# Altium project Standalone Battery Charger.PrjPcb (part 1 of 2)
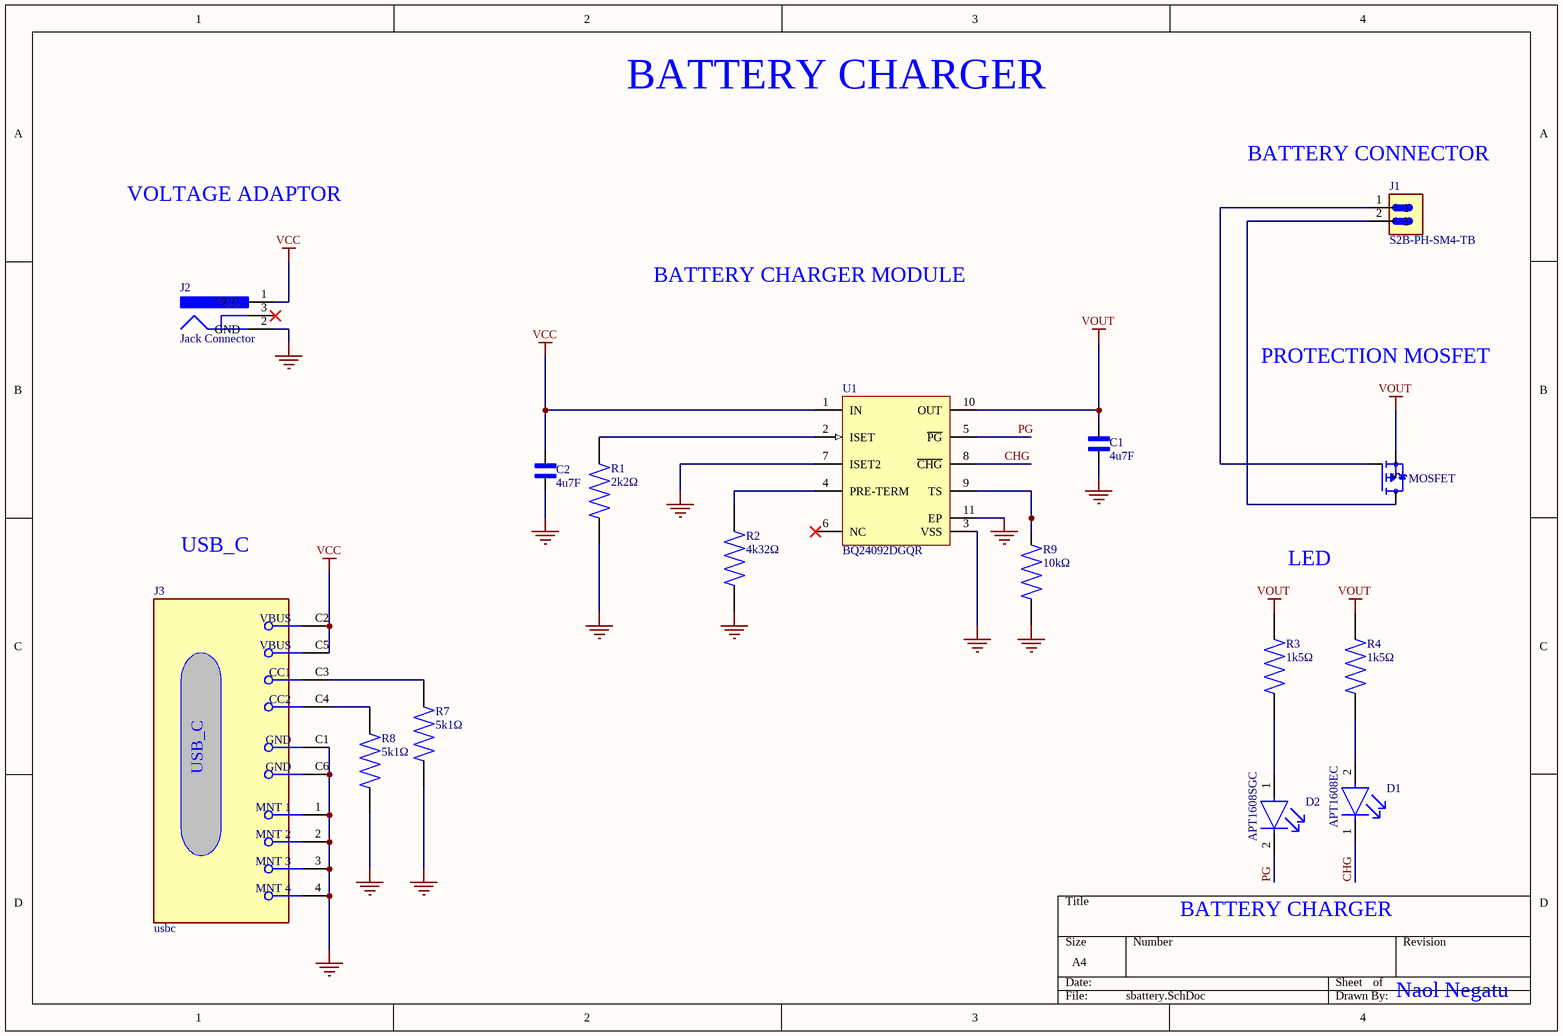
[diagram p0: sbattery.SchDoc]
1 sheet, 16 parts. Net scope: global (net labels, ports and power ports of the same name join across sheets).
Board file: sbattery.PcbDoc

## Sheet sbattery.SchDoc
size A4; SheetNumber: 1; SheetTotal: 1

### Parts
C1  4u7F  [CAPC2012X88N]
C2  4u7F  [CAPC2012X88N]
D1  APT1608EC  [FP-APT1608EC-MFG]
D2  APT1608SGC  [FP-APT2012MGC-MFG]
J1  S2B-PH-SM4-TB  [JST_S2B-PH-SM4-TB]
J2  Jack Connector  [CUI_PJ-002AH-SMT-TR]
J3  usbc  [FP-217176-0001-MFG]
MOSFET  P CHANNEL  [SOT23-3]  (value not drawn)
R1  2k2Ω  [RESC2012X60N]
R2  4k32Ω  [RESC2012X60N]
R3  1k5Ω  [RESC2012X60N]
R4  1k5Ω  [RESC2012X60N]
R7  5k1Ω  [RESC2012X60N]
R8  5k1Ω  [RESC2012X60N]
R9  10kΩ  [RESC2012X60N]
U1  BQ24092DGQR  [DGQ0010D_L]

### Nets
GND: C1.2 C2.2 J2.2(GND) J3.1(MNT_1) J3.2(MNT_2) J3.3(MNT_3) J3.4(MNT_4) J3.C1(GND) J3.C6(GND) R1.1 R2.1 R7.1 R8.1 R9.1 U1.3(VSS) U1.7(ISET2) U1.11(EP)
VCC: C2.1 J2.1(VCC) J3.C2(VBUS) J3.C5(VBUS) U1.1(IN)
VOUT: C1.1 MOSFET.2(S) R3.2 R4.2 U1.10(OUT)
CHG: D1.1(C) U1.8(~{CHG})
PG: D2.2(C) U1.5(~{PG})
NetD1_2: D1.2(A) R4.1
NetD2_1: D2.1(A) R3.1
NetJ1_1: J1.1 MOSFET.1(G)
NetJ1_2: J1.2 MOSFET.3(D)
NetJ3_C3: J3.C3(CC1) R7.2
NetJ3_C4: J3.C4(CC2) R8.2
NetR1_2: R1.2 U1.2(ISET)
NetR2_2: R2.2 U1.4(PRE-TERM)
NetR9_2: R9.2 U1.9(TS)

Not connected (* = marked no-connect by the designer): J2 3*; U1 6(NC)*

### Notes on the sheet
- BATTERY CHARGER
- (near J1) BATTERY CONNECTOR
- VOLTAGE ADAPTOR
- BATTERY CHARGER MODULE
- PROTECTION MOSFET
- USB_C
- LED
- Naol Negatu
- (in symbol 217176-0001) USB_C

### Library data of the parts
C1 C2 = CC0805KFX7R7BB475: Ceramic Capacitor, Ceramic, 16V, 10% +Tol, 10% -Tol, X7R, 0.15 TC, 4.7uF, Surface Mount, 0805; Manufacturer: Yageo Group; Manufacturer Package Identifier: CC0805-0.85; Supplier: DigiKey; Supplier Part Number: 13-CC0805KFX7R7BB475TR-ND; Manufacturer Part Number: CC0805KFX7R7BB475; RoHS: Compliant; Category: Ceramic Capacitors; Stock: 10000; Pricing: 10000=0.12617, 30000=0.11755 (USD); Value: 4.7uF; Case/Package: 0805; China RoHS: Compliant; Country of Origin: Mainland China, Taiwan; Dielectric: X7R; Dielectric Material: Ceramic; Export Control Classification Number (ECCN) Code: EAR99; Halogen Free: Halogen Free; Height: 1.25mm; Harmonized Tariff Schedule (HTS) Code: 8532.24.00.20; Introduction Date: 2013-05-20; Lead Free: Lead Free; Length: 2mm; Lifecycle Status: Production; Material: Ceramic; Max Operating Temperature: 125°C; Min Operating Temperature: -55°C; Mounting Technology: Surface Mount; Number of Terminals: 2; REACH SVHC: Unaffected; Voltage Rating: 16V; Voltage Rating (DC): 16V; Width: 1.25mm; ComponentLink1URL: https://datasheet.octopart.com:443/CC0805KFX7R7BB475-Yageo-datasheet-177165144.pdf?src-supplier=IHS; ComponentLink1Description: https://datasheet.octopart.com:443/CC0805KFX7R7BB475-Yageo-datasheet-177165144.pdf?src-supplier=IHS; ComponentLink2URL: https://datasheet.octopart.com:443/CC0805KFX7R7BB475-Yageo-datasheet-78855689.pdf?src-supplier=Upverter; ComponentLink2Description: https://datasheet.octopart.com:443/CC0805KFX7R7BB475-Yageo-datasheet-78855689.pdf?src-supplier=Upverter; ComponentLink3URL: https://datasheet.octopart.com:443/CC0805KFX7R7BB475-Yageo-datasheet-181969532.pdf?src-supplier=Farnell; ComponentLink3Description: https://datasheet.octopart.com:443/CC0805KFX7R7BB475-Yageo-datasheet-181969532.pdf?src-supplier=Farnell; ComponentLink4URL: https://datasheet.octopart.com/CC0805KFX7R7BB475-Yageo-datasheet-10883670.pdf; ComponentLink4Description: https://datasheet.octopart.com/CC0805KFX7R7BB475-Yageo-datasheet-10883670.pdf; ComponentLink5URL: http://sigma.octopart.com:80/conflict_mineral_statement/Yageo-company-3.pdf?src-supplier=Compliance+Statements; ComponentLink5Description: http://sigma.octopart.com:80/conflict_mineral_statement/Yageo-company-3.pdf?src-supplier=Compliance+Statements; ComponentLink6URL: http://sigma.octopart.com:80/rohs_statement/Yageo-company-2.pdf?src-supplier=Compliance+Statements; ComponentLink6Description: http://sigma.octopart.com:80/rohs_statement/Yageo-company-2.pdf?src-supplier=Compliance+Statements; LCSC part#: C20144929
D1 = APT1608EC: 1.6X0.8 MM SMD CHIP LED LAMP Single Color LED, High Efficiency Red, Water Clear, 1.2mm; Manufacturer: Kingbright; Dominant Wavelength: 625nm; Forward Current: 30mA; Forward Voltage: 2.5V; Lens Style: Clear, Flat; Luminous Intensity: 12mcd; Max Junction Temperature (Tj): 125°C; Number of Circuits: 1; Peak Wavelength: 627nm; Power Dissipation: 75mW; Reverse Voltage: 5V; Shape: Rectangular; Test Current: 20mA; Viewing Angle: 120°; Wavelength: 617nm; Supplier: DigiKey; Supplier Part Number: 754-1117-1-ND; Manufacturer Part Number: APT1608EC; RoHS: Compliant; Category: LEDs; Stock: 214921; Pricing: 1=0.19, 10=0.129, 100=0.0899, 500=0.07172, 1000=0.06568 (USD); Case/Package: 0603; Case Code (Imperial): 0603; Case Code (Metric): 1608; China RoHS: Compliant; Color: Red; Country of Origin: Mainland China; Height: 750µm; Harmonized Tariff Schedule (HTS) Code: 8541.40.20.00; Illumination Color: Red; Introduction Date: 2000-01-01; Lead Free: Lead Free; Length: 1.6mm; Lens Color: Clear; Lifecycle Status: Production; Max Operating Temperature: 85°C; Min Operating Temperature: -40°C; Mounting Technology: Surface Mount; Number of LEDs: 1; Pins: 2; Number of Terminals: 2; Packaging: Tape & Reel (TR); REACH SVHC: Unaffected; Schedule B: 8541402000, 8541402000|8541402000, 8541402000|8541402000|8541402000, 8541402000|8541402000|8541402000|8541402000; Terminal Pitch: 1.3mm; Width: 800µm; ComponentLink1URL: https://datasheet.octopart.com:443/APT1608EC-Kingbright-datasheet-180517227.pdf?src-supplier=IHS; ComponentLink1Description: https://datasheet.octopart.com:443/APT1608EC-Kingbright-datasheet-180517227.pdf?src-supplier=IHS; ComponentLink2URL: https://datasheet.octopart.com:443/APT1608EC-Kingbright-datasheet-158247.pdf?src-supplier=IHS; ComponentLink2Description: https://datasheet.octopart.com:443/APT1608EC-Kingbright-datasheet-158247.pdf?src-supplier=IHS; ComponentLink3URL: https://datasheet.octopart.com:443/APT1608EC-Kingbright-datasheet-12510518.pdf?src-supplier=Upverter; ComponentLink3Description: https://datasheet.octopart.com:443/APT1608EC-Kingbright-datasheet-12510518.pdf?src-supplier=Upverter; ComponentLink4URL: https://datasheet.octopart.com:443/APT1608EC-Kingbright-datasheet-137321905.pdf?src-supplier=Sager+Electronics; ComponentLink4Description: https://datasheet.octopart.com:443/APT1608EC-Kingbright-datasheet-137321905.pdf?src-supplier=Sager+Electronics; ComponentLink5URL: https://datasheet.octopart.com:443/APT1608EC-Kingbright-datasheet-9700807.pdf?src-supplier=RS+(Formerly+Allied+Electronics); ComponentLink5Description: https://datasheet.octopart.com:443/APT1608EC-Kingbright-datasheet-9700807.pdf?src-supplier=RS+(Formerly+Allied+Electronics); LCSC part#: C5554143
D2 = APT1608SGC: LED High-Power Uni-Color Super Bright Green 565nm 2.2V 2-Pin Chip LED T/R; Manufacturer: Kingbright; Dominant Wavelength: 568nm; Forward Current: 25mA; Forward Voltage: 2.5V; Lens Color: Clear; Lens Style: Clear, Flat; Luminous Intensity: 10mcd; Max Junction Temperature (Tj): 110°C; Number of Circuits: 1; Power Dissipation: 62.5mW; Reverse Voltage: 5V; Shape: Rectangular; Test Current: 20mA; Viewing Angle: 120°; Supplier: DigiKey; Supplier Part Number: 754-1121-1-ND; Manufacturer Part Number: APT1608SGC; RoHS: Compliant; Category: LEDs; Stock: 1784429; Pricing: 1=0.2, 10=0.137, 100=0.0953, 500=0.07602, 1000=0.06962 (USD); Case/Package: 0603; Case Code (Imperial): 0603; Case Code (Metric): 1608; China RoHS: Compliant; Color: Green; Height: 750µm; Illumination Color: Green; Lead Free: Lead Free; Length: 1.6mm; Lifecycle Status: Production; Max Operating Temperature: 85°C; Min Operating Temperature: -40°C; Mounting Technology: Surface Mount; Number of LEDs: 1; Pins: 2; Number of Terminals: 2; Packaging: Tape & Reel (TR); Peak Wavelength: 565nm; REACH SVHC: Unaffected; Schedule B: 8541402000, 8541402000|8541402000|8541402000|8541402000|8541402000|8541402000|8541402000|8541402000|8541402000|8541402000|8541402000|8541402000|8541402000|8541402000|8541402000|8541402000|8541402000|8541402000|8541402000|8541402000|8541402000|8541402000|8541402000|85; Terminal Pitch: 1.65mm; Wavelength: 568nm; Width: 800µm; ComponentLink1URL: https://datasheet.octopart.com:443/APT1608SGC-Kingbright-datasheet-180517294.pdf?src-supplier=IHS; ComponentLink1Description: https://datasheet.octopart.com:443/APT1608SGC-Kingbright-datasheet-180517294.pdf?src-supplier=IHS; ComponentLink2URL: https://datasheet.octopart.com:443/APT1608SGC-Kingbright-datasheet-158301.pdf?src-supplier=IHS; ComponentLink2Description: https://datasheet.octopart.com:443/APT1608SGC-Kingbright-datasheet-158301.pdf?src-supplier=IHS; ComponentLink3URL: https://datasheet.octopart.com:443/APT1608SGC-Kingbright-datasheet-8328416.pdf?src-supplier=Upverter; ComponentLink3Description: https://datasheet.octopart.com:443/APT1608SGC-Kingbright-datasheet-8328416.pdf?src-supplier=Upverter; LCSC part#: C5875754
J1 = S2B-PH-SM4-TB: Board Connector, 2 Contact(s), 1 Row(s), Male, Right Angle, Surface Mount Terminal; Manufacturer: JST; Contact Resistance: 20mΩ; Current Rating: 2A; Dielectric Material: Polyamide; Insulation Resistance: 1GΩ; Number of Poles: 2; Pitch: 2.0066mm; Ratings: CSA, TUV; Supplier: DigiKey; Supplier Part Number: 455-S2B-PH-SM4-TBCT-ND; Manufacturer Part Number: S2B-PH-SM4-TB; RoHS: Compliant; Category: Card Edge Connectors; Stock: 150546; Pricing: 1=0.49, 10=0.417, 100=0.3547, 500=0.31654 (USD); Case/Package: SMD/SMT; Contact Plating: Tin; Gender: Male; Height: 5.5mm; Length: 7.9mm; Lifecycle Status: Production; Max Operating Temperature: 85°C; Min Operating Temperature: -25°C; Pins: 2; Number of Positions: 2; Number of Rows: 1; Orientation: Right Angle; Terminal Pitch: 2mm; Width: 7.6mm; ComponentLink1URL: https://datasheet.octopart.com:443/S2B-PH-SM4-TB-JST-datasheet-15068535.pdf?src-supplier=IHS; ComponentLink1Description: https://datasheet.octopart.com:443/S2B-PH-SM4-TB-JST-datasheet-15068535.pdf?src-supplier=IHS; ComponentLink2URL: https://datasheet.octopart.com:443/S2B-PH-SM4-TB-JST-datasheet-12510261.pdf?src-supplier=TME; ComponentLink2Description: https://datasheet.octopart.com:443/S2B-PH-SM4-TB-JST-datasheet-12510261.pdf?src-supplier=TME; ComponentLink3URL: https://datasheet.octopart.com:443/S2B-PH-SM4-TB-JST-datasheet-159515011.pdf?src-supplier=HQonline; ComponentLink3Description: https://datasheet.octopart.com:443/S2B-PH-SM4-TB-JST-datasheet-159515011.pdf?src-supplier=HQonline
J2 = PJ-002AH-SMT-TR: 2.0 x 6.5 mm, 5.0 A, Horizontal, Surface Mount (SMT), Dc Power Jack Connector; Manufacturer: Same Sky; Current Rating: 5A; Inside Diameter: 2mm; Number of Conductors: 2; Outside Diameter: 6.5mm; Shielding: Unshielded; Voltage Rating: 24V; Supplier: DigiKey; Supplier Part Number: CP-002AHPJDKR-ND; Manufacturer Part Number: PJ-002AH-SMT-TR; RoHS: Compliant; Category: Power Connectors; Stock: 87808; Pricing: 1=1.31, 10=1.109, 25=1.0396, 50=0.99, 100=0.9426 (USD); Contact Plating: Silver; Country of Origin: Mainland China; Export Control Classification Number (ECCN) Code: EAR99; Harmonized Tariff Schedule (HTS) Code: 8536.69.40.20; Introduction Date: 2015-12-23; Lifecycle Status: Production; Max Operating Temperature: 85°C; Min Operating Temperature: -25°C; Mounting Technology: Surface Mount; Pins: 2; Orientation: Horizontal; REACH SVHC: Unaffected; Schedule B: 8536695050; Voltage Rating (DC): 24V; ComponentLink1URL: https://datasheet.octopart.com:443/PJ-002AH-SMT-TR-Same-Sky-datasheet-183081436.pdf?src-supplier=Same+Sky; ComponentLink1Description: https://datasheet.octopart.com:443/PJ-002AH-SMT-TR-Same-Sky-datasheet-183081436.pdf?src-supplier=Same+Sky; ComponentLink2URL: https://datasheet.octopart.com:443/PJ-002AH-SMT-TR-Same-Sky-datasheet-181917114.pdf?src-supplier=Same+Sky; ComponentLink2Description: https://datasheet.octopart.com:443/PJ-002AH-SMT-TR-Same-Sky-datasheet-181917114.pdf?src-supplier=Same+Sky; ComponentLink3URL: https://datasheet.octopart.com:443/PJ-002AH-SMT-TR-CUI-Devices-datasheet-175924689.pdf?src-supplier=Same+Sky; ComponentLink3Description: https://datasheet.octopart.com:443/PJ-002AH-SMT-TR-CUI-Devices-datasheet-175924689.pdf?src-supplier=Same+Sky; ComponentLink4URL: https://datasheet.octopart.com:443/PJ-002AH-SMT-TR-CUI-Devices-datasheet-137940666.pdf?src-supplier=Same+Sky; ComponentLink4Description: https://datasheet.octopart.com:443/PJ-002AH-SMT-TR-CUI-Devices-datasheet-137940666.pdf?src-supplier=Same+Sky; ComponentLink5URL: https://datasheet.octopart.com:443/PJ-002AH-SMT-TR-CUI-Devices-datasheet-180437148.pdf?src-supplier=IHS; ComponentLink5Description: https://datasheet.octopart.com:443/PJ-002AH-SMT-TR-CUI-Devices-datasheet-180437148.pdf?src-supplier=IHS; ComponentLink6URL: https://datasheet.octopart.com:443/PJ-002AH-SMT-TR-Same-Sky-datasheet-190141953.pdf?src-supplier=element14+APAC; ComponentLink6Description: https://datasheet.octopart.com:443/PJ-002AH-SMT-TR-Same-Sky-datasheet-190141953.pdf?src-supplier=element14+APAC; ComponentLink7URL: https://datasheet.octopart.com:443/PJ-002AH-SMT-TR-Same-Sky-datasheet-182880855.pdf?src-supplier=Electro+Sonic; ComponentLink7Description: https://datasheet.octopart.com:443/PJ-002AH-SMT-TR-Same-Sky-datasheet-182880855.pdf?src-supplier=Electro+Sonic; ComponentLink8URL: https://datasheet.octopart.com:443/PJ-002AH-SMT-TR-CUI-Devices-datasheet-175925525.pdf?src-supplier=Master+Electronics; ComponentLink8Description: https://datasheet.octopart.com:443/PJ-002AH-SMT-TR-CUI-Devices-datasheet-175925525.pdf?src-supplier=Master+Electronics; ComponentLink9URL: https://datasheet.octopart.com:443/PJ-002AH-SMT-TR-CUI-Devices-datasheet-141000103.pdf?src-supplier=Master+Electronics; ComponentLink9Description: https://datasheet.octopart.com:443/PJ-002AH-SMT-TR-CUI-Devices-datasheet-141000103.pdf?src-supplier=Master+Electronics; ComponentLink10URL: https://datasheet.octopart.com:443/PJ-002AH-SMT-TR-CUI-Devices-datasheet-103108616.pdf?src-supplier=Master+Electronics; ComponentLink10Description: https://datasheet.octopart.com:443/PJ-002AH-SMT-TR-CUI-Devices-datasheet-103108616.pdf?src-supplier=Master+Electronics; ComponentLink11URL: https://datasheet.octopart.com:443/PJ-002AH-SMT-TR-Same-Sky-datasheet-189105089.pdf?src-supplier=Master+Electronics; ComponentLink11Description: https://datasheet.octopart.com:443/PJ-002AH-SMT-TR-Same-Sky-datasheet-189105089.pdf?src-supplier=Master+Electronics; ComponentLink12URL: https://datasheet.octopart.com:443/PJ-002AH-SMT-TR-Same-Sky-datasheet-182049753.pdf?src-supplier=Future+Electronics; ComponentLink12Description: https://datasheet.octopart.com:443/PJ-002AH-SMT-TR-Same-Sky-datasheet-182049753.pdf?src-supplier=Future+Electronics; ComponentLink13URL: https://datasheet.octopart.com:443/PJ-002AH-SMT-TR-CUI-Devices-datasheet-175923546.pdf?src-supplier=Future+Electronics; ComponentLink13Description: https://datasheet.octopart.com:443/PJ-002AH-SMT-TR-CUI-Devices-datasheet-175923546.pdf?src-supplier=Future+Electronics; ComponentLink14URL: https://datasheet.octopart.com:443/PJ-002AH-SMT-TR-CUI-Devices-datasheet-137760669.pdf?src-supplier=Future+Electronics; ComponentLink14Description: https://datasheet.octopart.com:443/PJ-002AH-SMT-TR-CUI-Devices-datasheet-137760669.pdf?src-supplier=Future+Electronics; ComponentLink15URL: https://datasheet.octopart.com:443/PJ-002AH-SMT-TR-CUI-Devices-datasheet-175927503.pdf?src-supplier=CUI+Devices+SCT; ComponentLink15Description: https://datasheet.octopart.com:443/PJ-002AH-SMT-TR-CUI-Devices-datasheet-175927503.pdf?src-supplier=CUI+Devices+SCT; ComponentLink16URL: https://datasheet.octopart.com:443/PJ-002AH-SMT-TR-CUI-Devices-datasheet-142370533.pdf?src-supplier=CUI+Devices+SCT; ComponentLink16Description: https://datasheet.octopart.com:443/PJ-002AH-SMT-TR-CUI-Devices-datasheet-142370533.pdf?src-supplier=CUI+Devices+SCT; ComponentLink17URL: https://octopart.com:443/opatz8j6/c1?t=kYIPSAR_gxUrGLbD9baLFzEuLKDMD5QbHOfTDtLDkIqxLNdFXvSU7Zzvbvr2f7sXWfJxGRNhyTJmv_QM2CcXh6cB5txDjHKaRxA5LmQs8X3aOvPrphm1D1Gy4PUj3vydGShGnZzSROeM_0jDyTswWqCxsUuZ_G6TA39kgUgXMsYisotAvci6PBnwfHqprWkdovafhHLXXr438B9LgzH30NnnvdlFCxTuLfhx65YnuPwilhRuSo-RN6yLVuYx4bYU1Kz2gKifPRymKpwQpeAPMT-vPCIQg4kms4wOaB4PSnPbik8Fpc3R-s-2nw5NXz5D3_1YqpzlG--L1JdtoD8M3IP8kJK4AiMg9MwAvbI&src-supplier=Compliance+Statements; ComponentLink17Description: https://octopart.com:443/opatz8j6/c1?t=kYIPSAR_gxUrGLbD9baLFzEuLKDMD5QbHOfTDtLDkIqxLNdFXvSU7Zzvbvr2f7sXWfJxGRNhyTJmv_QM2CcXh6cB5txDjHKaRxA5LmQs8X3aOvPrphm1D1Gy4PUj3vydGShGnZzSROeM_0jDyTswWqCxsUuZ_G6TA39kgUgXMsYisotAvci6PBnwfHqprWkdovafhHLXXr438B9LgzH30NnnvdlFCxTuLfhx65YnuPwilhRuSo-RN6yLVuYx4bYU1Kz2gKifPRymKpwQpeAPMT-vPCIQg4kms4wOaB4PSnPbik8Fpc3R-s-2nw5NXz5D3_1YqpzlG--L1JdtoD8M3IP8kJK4AiMg9MwAvbI&src-supplier=Compliance+Statements; ComponentLink18URL: https://octopart.com:443/opatz8j6/c1?t=fCyWSj1jxHABX9bt1We-nBaONF-MKDyrdplWq9Ug6JX_mli73eFFCsHYdxw9c0yzn_n1hCXT5_MgR08zVo_XE-0LRftrscC4ncIG4fChnThfa4QkZ7D2kog3cmEkcq4mR6SQXbgR_BVap4JxImoweEwxe7EsrUn-gPrEzMW2H8ciz9OuWAMpPZ_4ifjdUiW6Du80lifleXXgru2rFP4QuH4Xg6petDpd_ciFnpWCXseW6pV3jSW7cwaSt3UROAB3Rgj_aBuMIzOubfE_Z-csyZ2KwTmrt1iiK2dgwigDFraz9g52IgOt5U_Koq0hn0IZE5PScfFEQBZO3DXy-6P3QmCScIzCxDK0aqapQeudmZ-b&src-supplier=Compliance+Statements; ComponentLink18Description: https://octopart.com:443/opatz8j6/c1?t=fCyWSj1jxHABX9bt1We-nBaONF-MKDyrdplWq9Ug6JX_mli73eFFCsHYdxw9c0yzn_n1hCXT5_MgR08zVo_XE-0LRftrscC4ncIG4fChnThfa4QkZ7D2kog3cmEkcq4mR6SQXbgR_BVap4JxImoweEwxe7EsrUn-gPrEzMW2H8ciz9OuWAMpPZ_4ifjdUiW6Du80lifleXXgru2rFP4QuH4Xg6petDpd_ciFnpWCXseW6pV3jSW7cwaSt3UROAB3Rgj_aBuMIzOubfE_Z-csyZ2KwTmrt1iiK2dgwigDFraz9g52IgOt5U_Koq0hn0IZE5PScfFEQBZO3DXy-6P3QmCScIzCxDK0aqapQeudmZ-b&src-supplier=Compliance+Statements; ComponentLink19URL: https://octopart.com:443/opatz8j6/c1?t=0G-ZbAozWDGaR5fAvdYjYVtahk3gonqNyEJgXYJdug8omsuN04aVXyE58rj41QlRKAj4lmPkVISqHmGdARiA99ILvFFkrrxah6GHPw6icDB6trS5MVDK3fgU_a4dZEeAnpK2Ogvp-0yutgNUwIMmgdbXs2uUjS2mosDdu4tICyz8yilXvZVabm6iwhWmm8-jY6OOJQggx-TMn65xiw5RMquBda3qZwV9eRGf3QHlh-G12LhJ3Hu32jBT-ZU5ne2OObtiOfBcZ5xkNxnCIi8vCc_XFZUgAheXvRHUilqF4Lu3rtnHWfWuyEiixHsIJalKzzqq94ThQJalGNRoZr9AuwcZBJKcZfHq-pyA3Uw&src-supplier=Compliance+Statements; ComponentLink19Description: https://octopart.com:443/opatz8j6/c1?t=0G-ZbAozWDGaR5fAvdYjYVtahk3gonqNyEJgXYJdug8omsuN04aVXyE58rj41QlRKAj4lmPkVISqHmGdARiA99ILvFFkrrxah6GHPw6icDB6trS5MVDK3fgU_a4dZEeAnpK2Ogvp-0yutgNUwIMmgdbXs2uUjS2mosDdu4tICyz8yilXvZVabm6iwhWmm8-jY6OOJQggx-TMn65xiw5RMquBda3qZwV9eRGf3QHlh-G12LhJ3Hu32jBT-ZU5ne2OObtiOfBcZ5xkNxnCIi8vCc_XFZUgAheXvRHUilqF4Lu3rtnHWfWuyEiixHsIJalKzzqq94ThQJalGNRoZr9AuwcZBJKcZfHq-pyA3Uw&src-supplier=Compliance+Statements; ComponentLink20URL: https://octopart.com:443/opatz8j6/c1?t=O9FJ77n277rZYT1vkW-sWDyE1Ea4dVQNwVeXrCs_O4FYIapCNdmThiJo2jJrijPrL5plgIdh588x2jFYVz6_ITNsv76ycHfSK8IUBrcl_7pxBzvZPRWXWk3EBfsemLjM5yV3VaWa1Vo-8vRT0cyQB5zJkMm-fcl1dDgpq3pzZBR-jy3vPTE_fAtu0Xoza9pCNi_-J4HQu4RdNbXTh_Ts3xIhgv7O5lVkarbUzKhnZRmGVQS2fagVjKU-i7LcVv1hTKNIVRxniNVql0YCjdDdjd0--Hqa6cpsza62t2-gsN6fkLgXXcnbAoJISjka-kHDmTuIB7ntE-61a8hiS-W_NX0-Y6auNOsYkr9uJQIUeTVs&src-supplier=Compliance+Statements; ComponentLink20Description: https://octopart.com:443/opatz8j6/c1?t=O9FJ77n277rZYT1vkW-sWDyE1Ea4dVQNwVeXrCs_O4FYIapCNdmThiJo2jJrijPrL5plgIdh588x2jFYVz6_ITNsv76ycHfSK8IUBrcl_7pxBzvZPRWXWk3EBfsemLjM5yV3VaWa1Vo-8vRT0cyQB5zJkMm-fcl1dDgpq3pzZBR-jy3vPTE_fAtu0Xoza9pCNi_-J4HQu4RdNbXTh_Ts3xIhgv7O5lVkarbUzKhnZRmGVQS2fagVjKU-i7LcVv1hTKNIVRxniNVql0YCjdDdjd0--Hqa6cpsza62t2-gsN6fkLgXXcnbAoJISjka-kHDmTuIB7ntE-61a8hiS-W_NX0-Y6auNOsYkr9uJQIUeTVs&src-supplier=Compliance+Statements; LCSC part#: C2961147
J3 = 217176-0001: USB Connector, Receptacle, USB 2.0, USB Type C, 6 Ways, Gold, SMT, Right Angle, Copper Alloy; Manufacturer: Molex; Manufacturer Lifecycle Status: ACTIVE; Contact Resistance: 50mΩ; Current Rating: 1.25A; Gender: Female; Insulation Resistance: 100MΩ; Number of Contacts: 6; Number of Ports: 1; Plating Thickness: 25.4nm; USB Standard: USB 2.0; Voltage Rating: 30V; Supplier: Avnet; Supplier Part Number: 217176-0001; Manufacturer Part Number: 217176-0001; RoHS: Compliant; Category: USB Connectors; Stock: 32400; Pricing: 3600=1.1115, 10800=0.95376, 21600=0.91268, 43200=0.84734, 100800=0.8202 (USD); China RoHS: Compliant; Contact Material: Gold, Nickel; Country of Origin: Mainland China; Export Control Classification Number (ECCN) Code: EAR99; Harmonized Tariff Schedule (HTS) Code: 8536.69.40.30; Insulation Color: Black; Introduction Date: 2021-08-26; Lifecycle Status: Production; Max Operating Temperature: 85°C; Min Operating Temperature: -40°C; Pins: 6; Number of Positions: 6; Number of Rows: 1; Orientation: Right Angle; REACH SVHC: Unaffected; Shell Finish: Nickel; Shell Material: Stainless Steel; Terminal Pitch: 1.02mm; ComponentLink1URL: https://sigma.octopart.com:443/158830329/technical_drawing/Molex-217176-0001.pdf?src-supplier=Upverter; ComponentLink1Description: https://sigma.octopart.com:443/158830329/technical_drawing/Molex-217176-0001.pdf?src-supplier=Upverter; ComponentLink2URL: https://datasheet.octopart.com:443/217176-0001-Molex-datasheet-164573281.pdf?src-supplier=RS+(Formerly+Allied+Electronics); ComponentLink2Description: https://datasheet.octopart.com:443/217176-0001-Molex-datasheet-164573281.pdf?src-supplier=RS+(Formerly+Allied+Electronics); ComponentLink3URL: http://sigma.octopart.com:80/reach_statement/Molex-company-74.pdf?src-supplier=Compliance+Statements; ComponentLink3Description: http://sigma.octopart.com:80/reach_statement/Molex-company-74.pdf?src-supplier=Compliance+Statements; ComponentLink4URL: http://sigma.octopart.com:80/rohs_statement/Molex-company-73.pdf?src-supplier=Compliance+Statements; ComponentLink4Description: http://sigma.octopart.com:80/rohs_statement/Molex-company-73.pdf?src-supplier=Compliance+Statements; ComponentLink5URL: http://sigma.octopart.com:80/conflict_mineral_statement/Molex-company-72.pdf?src-supplier=Compliance+Statements; ComponentLink5Description: http://sigma.octopart.com:80/conflict_mineral_statement/Molex-company-72.pdf?src-supplier=Compliance+Statements; LCSC part#: C3197950
MOSFET = AO3401A: Transistor: P-MOSFET; unipolar; -30V; 4, 2A; 1, 4W; 85 mOhm; ; -55+150 st.C; SMD; SOT23; Manufacturer: Alpha & Omega Semiconductor; Continuous Drain Current (ID): 4A; Drain to Source Resistance: 50mΩ; Gate to Source Voltage (Vgs): 12V; Input Capacitance: 1.2nF; Max Junction Temperature (Tj): 150°C; Max Power Dissipation: 1.4W; Min Breakdown Voltage: 30V; Number of Channels: 1; Rds On Max: 44mΩ; Threshold Voltage: -900mV; Turn-Off Delay Time: 41ns; Turn-On Delay Time: 6.5ns; Supplier: DigiKey; Supplier Part Number: 785-1001-1-ND; Manufacturer Part Number: AO3401A; RoHS: Compliant; Category: MOSFETs; Stock: 390499; Pricing: 1=0.52, 10=0.322, 50=0.2332, 100=0.2043, 500=0.15316 (USD); Case/Package: TO-236-3; Country of Origin: Mainland China; Drain to Source Breakdown Voltage: -30V; Drain to Source Voltage (Vds): -30V; Export Control Classification Number (ECCN) Code: EAR99; Height: 1.25mm; Introduction Date: 2007-04-10; Lead Free: Lead Free; Lifecycle Status: Production; Max Operating Temperature: 150°C; Min Operating Temperature: -55°C; Mounting Technology: Surface Mount; Number of Elements: 1; Pins: 3; Number of Terminals: 3; Power Dissipation: 1.4W; Radiation Hardening: No; REACH SVHC: Unaffected; Schedule B: 8541290080, 8541290080|8541290080|8541290080|8541290080|8541290080; ComponentLink1URL: https://datasheet.octopart.com:443/AO3401A-Alpha-%26-Omega-Semiconductor-datasheet-11631723.pdf?src-supplier=IHS; ComponentLink1Description: https://datasheet.octopart.com:443/AO3401A-Alpha-%26-Omega-Semiconductor-datasheet-11631723.pdf?src-supplier=IHS; ComponentLink2URL: https://sigma.octopart.com:443/138895710/technical_drawing/Alpha-%26-Omega-Semiconductor-AO3401A.pdf?src-supplier=Upverter; ComponentLink2Description: https://sigma.octopart.com:443/138895710/technical_drawing/Alpha-%26-Omega-Semiconductor-AO3401A.pdf?src-supplier=Upverter; ComponentLink3URL: https://sigma.octopart.com:443/140150677/technical_drawing/Alpha-%26-Omega-Semiconductor-AO3401A.pdf?src-supplier=Alpha+%26+Omega+Semiconductor+SCT; ComponentLink3Description: https://sigma.octopart.com:443/140150677/technical_drawing/Alpha-%26-Omega-Semiconductor-AO3401A.pdf?src-supplier=Alpha+%26+Omega+Semiconductor+SCT; ComponentLink4URL: https://datasheet.octopart.com:443/AO3401A-Alpha-%26-Omega-Semiconductor-datasheet-14060796.pdf?src-supplier=iiiC; ComponentLink4Description: https://datasheet.octopart.com:443/AO3401A-Alpha-%26-Omega-Semiconductor-datasheet-14060796.pdf?src-supplier=iiiC; LCSC part#: C15127
R1 = RC0805FR-072K2L: 125Mw Thick Film Resistors 100Ppm/ 1% 2.2K 0805 Chip Resistor Surface Mount Rohs; Manufacturer: Yageo Group; Value: 2.2kΩ; Temperature Coefficient: 100ppm/°C; Voltage Rating: 150V; Supplier: DigiKey; Supplier Part Number: 311-2.20KCRCT-ND; Manufacturer Part Number: RC0805FR-072K2L; RoHS: Compliant; Category: Chip SMD Resistors; Stock: 451947; Pricing: 1=0.1, 10=0.034, 25=0.0256, 50=0.0208, 100=0.0171, 250=0.01344, 500=0.01136, 1000=0.00973 (USD); Case/Package: 0805; Case Code (Imperial): 0805; China RoHS: Non-Compliant; Composition: Thick Film; Contact Plating: Tin; Depth: 1.25mm; Features: Moisture Resistant; Height: 500µm; Lead Free: Lead Free; Lead Pitch: 400µm; Length: 2mm; Lifecycle Status: Production; Max Operating Temperature: 155°C; Max Power Dissipation: 125mW; Military Standard: Not; Min Operating Temperature: -55°C; Mounting Technology: Surface Mount; Pins: 2; Number of Terminals: 2; Number of Terminations: 2; Packaging: Tape & Reel; Power Rating: 125mW; Radiation Hardening: No; REACH SVHC: Unaffected; Schedule B: 8533210045, 8533210045|8533210045, 8533210045|8533210045|8533210045, 8533210045|8533210045|8533210045|8533210045; Termination: SMD/SMT; Tolerance: 1%; Voltage Rating (AC): 150V; Voltage Rating (DC): 150V; Width: 1.25mm; Working Voltage: 150V; ComponentLink1URL: https://datasheet.octopart.com:443/RC0805FR-072K2L-Yageo-datasheet-175887523.pdf?src-supplier=element14+APAC; ComponentLink1Description: https://datasheet.octopart.com:443/RC0805FR-072K2L-Yageo-datasheet-175887523.pdf?src-supplier=element14+APAC; ComponentLink2URL: https://datasheet.octopart.com:443/RC0805FR-072K2L-Yageo-datasheet-62067350.pdf?src-supplier=element14+APAC; ComponentLink2Description: https://datasheet.octopart.com:443/RC0805FR-072K2L-Yageo-datasheet-62067350.pdf?src-supplier=element14+APAC; ComponentLink3URL: https://datasheet.octopart.com:443/RC0805FR-072K2L-Yageo-datasheet-103092701.pdf?src-supplier=Upverter; ComponentLink3Description: https://datasheet.octopart.com:443/RC0805FR-072K2L-Yageo-datasheet-103092701.pdf?src-supplier=Upverter; ComponentLink4URL: https://datasheet.octopart.com:443/RC0805FR-072K2L-Yageo-datasheet-8330313.pdf?src-supplier=Newark; ComponentLink4Description: https://datasheet.octopart.com:443/RC0805FR-072K2L-Yageo-datasheet-8330313.pdf?src-supplier=Newark; ComponentLink5URL: https://datasheet.octopart.com:443/RC0805FR-072K2L-Yageo-Group-datasheet-190305687.pdf?src-supplier=Newark; ComponentLink5Description: https://datasheet.octopart.com:443/RC0805FR-072K2L-Yageo-Group-datasheet-190305687.pdf?src-supplier=Newark; ComponentLink6URL: https://datasheet.octopart.com:443/RC0805FR-072K2L-Yageo-Group-datasheet-176638170.pdf?src-supplier=Future+Electronics; ComponentLink6Description: https://datasheet.octopart.com:443/RC0805FR-072K2L-Yageo-Group-datasheet-176638170.pdf?src-supplier=Future+Electronics; ComponentLink7URL: https://datasheet.octopart.com:443/RC0805FR-072K2L-Yageo-datasheet-164759695.pdf?src-supplier=Future+Electronics; ComponentLink7Description: https://datasheet.octopart.com:443/RC0805FR-072K2L-Yageo-datasheet-164759695.pdf?src-supplier=Future+Electronics; ComponentLink8URL: https://datasheet.octopart.com:443/RC0805FR-072K2L-Yageo-datasheet-12592811.pdf?src-supplier=Future+Electronics; ComponentLink8Description: https://datasheet.octopart.com:443/RC0805FR-072K2L-Yageo-datasheet-12592811.pdf?src-supplier=Future+Electronics; ComponentLink9URL: https://datasheet.octopart.com:443/RC0805FR-072K2L-Yageo-datasheet-8324252.pdf?src-supplier=Future+Electronics; ComponentLink9Description: https://datasheet.octopart.com:443/RC0805FR-072K2L-Yageo-datasheet-8324252.pdf?src-supplier=Future+Electronics; ComponentLink10URL: https://datasheet.octopart.com:443/RC0805FR-072K2L-Yageo-datasheet-79472498.pdf?src-supplier=Megastar; ComponentLink10Description: https://datasheet.octopart.com:443/RC0805FR-072K2L-Yageo-datasheet-79472498.pdf?src-supplier=Megastar; ComponentLink11URL: https://datasheet.octopart.com/RC0805FR-072K2L-Yageo-datasheet-73766026.pdf; ComponentLink11Description: https://datasheet.octopart.com/RC0805FR-072K2L-Yageo-datasheet-73766026.pdf; ComponentLink12URL: https://datasheet.octopart.com:443/RC0805FR-072K2L-Yageo-datasheet-13691069.pdf?src-supplier=Farnell; ComponentLink12Description: https://datasheet.octopart.com:443/RC0805FR-072K2L-Yageo-datasheet-13691069.pdf?src-supplier=Farnell; ComponentLink13URL: https://datasheet.octopart.com:443/RC0805FR-072K2L-Yageo-datasheet-118657.pdf?src-supplier=DigiKey; ComponentLink13Description: https://datasheet.octopart.com:443/RC0805FR-072K2L-Yageo-datasheet-118657.pdf?src-supplier=DigiKey; ComponentLink14URL: http://sigma.octopart.com:80/conflict_mineral_statement/Yageo-company-3.pdf?src-supplier=Compliance+Statements; ComponentLink14Description: http://sigma.octopart.com:80/conflict_mineral_statement/Yageo-company-3.pdf?src-supplier=Compliance+Statements; ComponentLink15URL: http://sigma.octopart.com:80/rohs_statement/Yageo-company-2.pdf?src-supplier=Compliance+Statements; ComponentLink15Description: http://sigma.octopart.com:80/rohs_statement/Yageo-company-2.pdf?src-supplier=Compliance+Statements; LCSC part#: C114561
R2 = RC0805FR-074K32L: Res Thick Film 0805 4.32K Ohm 1% 0.125W(1/8W) ±100ppm/C Pad SMD T/R; Manufacturer: Yageo Group; Manufacturer Package Identifier: 0805 (2012 metric); Max Power Dissipation: 125mW; Value: 4.32kΩ; Temperature Coefficient: 100ppm/°C; Voltage Rating: 150V; Supplier: DigiKey; Supplier Part Number: 311-4.32KCRCT-ND; Manufacturer Part Number: RC0805FR-074K32L; RoHS: Compliant; Category: Chip SMD Resistors; Stock: 2956; Pricing: 1=0.1, 10=0.034, 25=0.0256, 50=0.0208, 100=0.0171, 250=0.01344, 500=0.01136, 1000=0.00973 (USD); Case/Package: 0805; Case Code (Imperial): 0805; China RoHS: Non-Compliant; Composition: Thick Film; Contact Plating: Lead, Tin; Country of Origin: Mainland China, Taiwan; Depth: 1.25mm; Export Control Classification Number (ECCN) Code: EAR99; Features: Moisture Resistant; Height: 500µm; Harmonized Tariff Schedule (HTS) Code: 8533.21.00.30; Introduction Date: 2004-09-22; Lead Free: Lead Free; Length: 2mm; Lifecycle Status: Production; Max Operating Temperature: 155°C; Military Standard: Not; Min Operating Temperature: -55°C; Mounting Technology: Surface Mount; Number of Terminals: 2; Number of Terminations: 2; Power Rating: 125mW; Radiation Hardening: No; REACH SVHC: Unaffected; Schedule B: 8533210045, 8533210045|8533210045, 8533210045|8533210045|8533210045, 8533210045|8533210045|8533210045|8533210045; Termination: SMD/SMT; Tolerance: 1%; Voltage Rating (DC): 150V; Width: 1.25mm; Working Voltage: 150V; ComponentLink1URL: https://datasheet.octopart.com:443/RC0805FR-074K32L-Yageo-datasheet-175887523.pdf?src-supplier=IHS; ComponentLink1Description: https://datasheet.octopart.com:443/RC0805FR-074K32L-Yageo-datasheet-175887523.pdf?src-supplier=IHS; ComponentLink2URL: https://datasheet.octopart.com:443/RC0805FR-074K32L-Yageo-datasheet-103092701.pdf?src-supplier=Upverter; ComponentLink2Description: https://datasheet.octopart.com:443/RC0805FR-074K32L-Yageo-datasheet-103092701.pdf?src-supplier=Upverter; ComponentLink3URL: https://datasheet.octopart.com:443/RC0805FR-074K32L-Yageo-Group-datasheet-176638170.pdf?src-supplier=Future+Electronics; ComponentLink3Description: https://datasheet.octopart.com:443/RC0805FR-074K32L-Yageo-Group-datasheet-176638170.pdf?src-supplier=Future+Electronics; ComponentLink4URL: https://datasheet.octopart.com:443/RC0805FR-074K32L-Yageo-datasheet-164759695.pdf?src-supplier=Future+Electronics; ComponentLink4Description: https://datasheet.octopart.com:443/RC0805FR-074K32L-Yageo-datasheet-164759695.pdf?src-supplier=Future+Electronics; ComponentLink5URL: https://datasheet.octopart.com:443/RC0805FR-074K32L-Yageo-datasheet-12592811.pdf?src-supplier=Future+Electronics; ComponentLink5Description: https://datasheet.octopart.com:443/RC0805FR-074K32L-Yageo-datasheet-12592811.pdf?src-supplier=Future+Electronics; ComponentLink6URL: https://datasheet.octopart.com:443/RC0805FR-074K32L-Yageo-datasheet-8324252.pdf?src-supplier=Future+Electronics; ComponentLink6Description: https://datasheet.octopart.com:443/RC0805FR-074K32L-Yageo-datasheet-8324252.pdf?src-supplier=Future+Electronics; ComponentLink7URL: https://datasheet.octopart.com:443/RC0805FR-074K32L-Yageo-datasheet-8330313.pdf?src-supplier=Burklin+Elektronik; ComponentLink7Description: https://datasheet.octopart.com:443/RC0805FR-074K32L-Yageo-datasheet-8330313.pdf?src-supplier=Burklin+Elektronik; ComponentLink8URL: https://datasheet.octopart.com:443/RC0805FR-074K32L-Yageo-Group-datasheet-189192902.pdf?src-supplier=TME; ComponentLink8Description: https://datasheet.octopart.com:443/RC0805FR-074K32L-Yageo-Group-datasheet-189192902.pdf?src-supplier=TME; ComponentLink9URL: https://datasheet.octopart.com/RC0805FR-074K32L-Yageo-datasheet-73766026.pdf; ComponentLink9Description: https://datasheet.octopart.com/RC0805FR-074K32L-Yageo-datasheet-73766026.pdf; ComponentLink10URL: https://datasheet.octopart.com:443/RC0805FR-074K32L-Yageo-datasheet-118657.pdf?src-supplier=DigiKey; ComponentLink10Description: https://datasheet.octopart.com:443/RC0805FR-074K32L-Yageo-datasheet-118657.pdf?src-supplier=DigiKey; ComponentLink11URL: http://sigma.octopart.com:80/conflict_mineral_statement/Yageo-company-3.pdf?src-supplier=Compliance+Statements; ComponentLink11Description: http://sigma.octopart.com:80/conflict_mineral_statement/Yageo-company-3.pdf?src-supplier=Compliance+Statements; ComponentLink12URL: http://sigma.octopart.com:80/rohs_statement/Yageo-company-2.pdf?src-supplier=Compliance+Statements; ComponentLink12Description: http://sigma.octopart.com:80/rohs_statement/Yageo-company-2.pdf?src-supplier=Compliance+Statements; LCSC part#: C483139
R3 R4 = RC0805JR-131K5L: Res Thick Film 0805 1.5K Ohm 5% 0.125W(1/8W) ±100ppm/C Pad SMD T/R; Manufacturer: Yageo Group; Power Rating: 125mW; Value: 1.5kΩ; Temperature Coefficient: 100ppm/°C; Voltage Rating: 150V; Supplier: DigiKey; Supplier Part Number: 13-RC0805JR-131K5LCT-ND; Manufacturer Part Number: RC0805JR-131K5L; RoHS: Compliant; Category: Chip SMD Resistors; Stock: 95872; Pricing: 1=0.1, 10=0.032, 25=0.0236, 50=0.019, 100=0.0155, 250=0.01216, 500=0.01024, 1000=0.00873, 5000=0.00636 (USD); Case/Package: 0805; Case Code (Imperial): 0805; Case Code (Metric): 2012; China RoHS: Non-Compliant; Composition: Thick Film; Contact Plating: Lead, Tin; Country of Origin: Mainland China, Taiwan; Depth: 1.25mm; Export Control Classification Number (ECCN) Code: EAR99; Height: 500µm; Harmonized Tariff Schedule (HTS) Code: 8533.21.00.30; Introduction Date: 2004-09-22; Lead Free: Lead Free; Length: 2mm; Lifecycle Status: Production; Max Operating Temperature: 155°C; Military Standard: Not; Min Operating Temperature: -55°C; Mounting Technology: Surface Mount; Number of Terminals: 2; Radiation Hardening: No; REACH SVHC: Unaffected; Termination: SMD/SMT; Tolerance: 5%; Width: 1.25mm; Working Voltage: 150V; ComponentLink1URL: https://datasheet.octopart.com:443/RC0805JR-131K5L-Yageo-datasheet-175887523.pdf?src-supplier=IHS; ComponentLink1Description: https://datasheet.octopart.com:443/RC0805JR-131K5L-Yageo-datasheet-175887523.pdf?src-supplier=IHS; ComponentLink2URL: https://datasheet.octopart.com:443/RC0805JR-131K5L-Yageo-Group-datasheet-176638170.pdf?src-supplier=Future+Electronics; ComponentLink2Description: https://datasheet.octopart.com:443/RC0805JR-131K5L-Yageo-Group-datasheet-176638170.pdf?src-supplier=Future+Electronics; ComponentLink3URL: https://datasheet.octopart.com:443/RC0805JR-131K5L-Yageo-Group-datasheet-164759695.pdf?src-supplier=Future+Electronics; ComponentLink3Description: https://datasheet.octopart.com:443/RC0805JR-131K5L-Yageo-Group-datasheet-164759695.pdf?src-supplier=Future+Electronics; ComponentLink4URL: https://datasheet.octopart.com:443/RC0805JR-131K5L-Yageo-datasheet-148775077.pdf?src-supplier=TME; ComponentLink4Description: https://datasheet.octopart.com:443/RC0805JR-131K5L-Yageo-datasheet-148775077.pdf?src-supplier=TME; ComponentLink5URL: https://datasheet.octopart.com/RC0805JR-131K5L-Yageo-datasheet-73766026.pdf; ComponentLink5Description: https://datasheet.octopart.com/RC0805JR-131K5L-Yageo-datasheet-73766026.pdf; ComponentLink6URL: http://sigma.octopart.com:80/conflict_mineral_statement/Yageo-company-3.pdf?src-supplier=Compliance+Statements; ComponentLink6Description: http://sigma.octopart.com:80/conflict_mineral_statement/Yageo-company-3.pdf?src-supplier=Compliance+Statements; ComponentLink7URL: http://sigma.octopart.com:80/rohs_statement/Yageo-company-2.pdf?src-supplier=Compliance+Statements; ComponentLink7Description: http://sigma.octopart.com:80/rohs_statement/Yageo-company-2.pdf?src-supplier=Compliance+Statements; LCSC part#: C114737
R7 R8 = RC0805FR-135K1L: Res Thick Film 0805 5.1K Ohm 1% 0.125W(1/8W) ±100ppm/C Pad SMD T/R; Manufacturer: Yageo Group; Power Rating: 125mW; Value: 5.1kΩ; Temperature Coefficient: 100ppm/°C; Voltage Rating: 150V; Supplier: DigiKey; Supplier Part Number: 13-RC0805FR-135K1LDKR-ND; Manufacturer Part Number: RC0805FR-135K1L; RoHS: Compliant; Category: Chip SMD Resistors; Stock: 41211; Pricing: 1=0.1, 10=0.034, 25=0.0256, 50=0.0208, 100=0.0171, 250=0.01344, 500=0.01136, 1000=0.00973, 5000=0.00715 (USD); Case/Package: 0805; Case Code (Imperial): 0805; Case Code (Metric): 2012; China RoHS: Non-Compliant; Composition: Thick Film; Contact Plating: Tin; Country of Origin: Mainland China, Taiwan; Depth: 1.25mm; Export Control Classification Number (ECCN) Code: EAR99; Height: 500µm; Harmonized Tariff Schedule (HTS) Code: 8533.21.00.30; Introduction Date: 2004-09-22; Length: 2mm; Lifecycle Status: Production; Max Operating Temperature: 155°C; Military Standard: Not; Min Operating Temperature: -55°C; Mounting Technology: Surface Mount; Number of Terminals: 2; Radiation Hardening: No; REACH SVHC: Unaffected; Schedule B: 8533210045, 8533210045|8533210045|8533210045|8533210045|8533210045; Termination: SMD/SMT; Tolerance: 1%; Width: 1.25mm; Working Voltage: 150V; ComponentLink1URL: https://datasheet.octopart.com:443/RC0805FR-135K1L-Yageo-datasheet-175887523.pdf?src-supplier=IHS; ComponentLink1Description: https://datasheet.octopart.com:443/RC0805FR-135K1L-Yageo-datasheet-175887523.pdf?src-supplier=IHS; ComponentLink2URL: https://datasheet.octopart.com:443/RC0805FR-135K1L-Yageo-Group-datasheet-176638170.pdf?src-supplier=Future+Electronics; ComponentLink2Description: https://datasheet.octopart.com:443/RC0805FR-135K1L-Yageo-Group-datasheet-176638170.pdf?src-supplier=Future+Electronics; ComponentLink3URL: https://datasheet.octopart.com:443/RC0805FR-135K1L-Yageo-datasheet-164759695.pdf?src-supplier=Future+Electronics; ComponentLink3Description: https://datasheet.octopart.com:443/RC0805FR-135K1L-Yageo-datasheet-164759695.pdf?src-supplier=Future+Electronics; ComponentLink4URL: https://datasheet.octopart.com/RC0805FR-135K1L-Yageo-datasheet-73766026.pdf; ComponentLink4Description: https://datasheet.octopart.com/RC0805FR-135K1L-Yageo-datasheet-73766026.pdf; ComponentLink5URL: http://sigma.octopart.com:80/conflict_mineral_statement/Yageo-company-3.pdf?src-supplier=Compliance+Statements; ComponentLink5Description: http://sigma.octopart.com:80/conflict_mineral_statement/Yageo-company-3.pdf?src-supplier=Compliance+Statements; ComponentLink6URL: http://sigma.octopart.com:80/rohs_statement/Yageo-company-2.pdf?src-supplier=Compliance+Statements; ComponentLink6Description: http://sigma.octopart.com:80/rohs_statement/Yageo-company-2.pdf?src-supplier=Compliance+Statements; LCSC part#: C4200156
R9 = RMCF0805FT10K0: Res Thick Film 0805 10K Ohm 1% 0.125W ±100ppm/°C Molded SMD Paper T/R; Manufacturer: Stackpole Electronics; Manufacturer Package Identifier: 0805 (2012 metric); Max Power Dissipation: 125mW; Voltage Rating: 150V; Supplier: DigiKey; Supplier Part Number: RMCF0805FT10K0DKR-ND; Manufacturer Part Number: RMCF0805FT10K0; RoHS: Compliant; Category: Chip SMD Resistors; Stock: 3852379; Pricing: 1=0.1, 10=0.027, 25=0.0196, 50=0.0156, 100=0.0127, 250=0.00988, 500=0.00824, 1000=0.00697 (USD); Case/Package: 0805; Case Code (Imperial): 0805; Case Code (Metric): 2012; China RoHS: Non-Compliant; Composition: Thick Film; Contact Plating: Tin; Depth: 1.25mm; Features: Automotive AEC-Q200; Height: 500µm; Lead Free: Lead Free; Length: 2mm; Lifecycle Status: Production; Max Operating Temperature: 155°C; Military Standard: Not; Min Operating Temperature: -55°C; Mounting Technology: Surface Mount; Number of Terminals: 2; Number of Terminations: 2; Packaging: Cut Tape (CT); Power Rating: 125mW; Radiation Hardening: No; Ratings: AEC-Q200; REACH SVHC: Unaffected; Value: 10kΩ; Schedule B: 8533210045, 8533210045|8533210045, 8533210045|8533210045|8533210045, 8533210045|8533210045|8533210045|8533210045; Temperature Coefficient: 100ppm/°C; Tolerance: 1%; Width: 1.25mm; Working Voltage: 150V; ComponentLink1URL: https://datasheet.octopart.com:443/RMCF0805FT10K0-Stackpole-Electronics-datasheet-182148065.pdf?src-supplier=IHS; ComponentLink1Description: https://datasheet.octopart.com:443/RMCF0805FT10K0-Stackpole-Electronics-datasheet-182148065.pdf?src-supplier=IHS; ComponentLink2URL: https://datasheet.octopart.com:443/RMCF0805FT10K0-Stackpole-Electronics-datasheet-12534581.pdf?src-supplier=Upverter; ComponentLink2Description: https://datasheet.octopart.com:443/RMCF0805FT10K0-Stackpole-Electronics-datasheet-12534581.pdf?src-supplier=Upverter; ComponentLink3URL: https://datasheet.octopart.com:443/RMCF0805FT10K0-Stackpole-Electronics-datasheet-12510902.pdf?src-supplier=Upverter; ComponentLink3Description: https://datasheet.octopart.com:443/RMCF0805FT10K0-Stackpole-Electronics-datasheet-12510902.pdf?src-supplier=Upverter; ComponentLink4URL: https://datasheet.octopart.com:443/RMCF0805FT10K0-Stackpole-Electronics-datasheet-28504820.pdf?src-supplier=Master+Electronics; ComponentLink4Description: https://datasheet.octopart.com:443/RMCF0805FT10K0-Stackpole-Electronics-datasheet-28504820.pdf?src-supplier=Master+Electronics; ComponentLink5URL: https://datasheet.octopart.com:443/RMCF0805FT10K0-Stackpole-Electronics-datasheet-141193804.pdf?src-supplier=Stackpole+Electronics; ComponentLink5Description: https://datasheet.octopart.com:443/RMCF0805FT10K0-Stackpole-Electronics-datasheet-141193804.pdf?src-supplier=Stackpole+Electronics; ComponentLink6URL: https://datasheet.octopart.com:443/RMCF0805FT10K0-Stackpole-Electronics-datasheet-62091608.pdf?src-supplier=Stackpole+Electronics; ComponentLink6Description: https://datasheet.octopart.com:443/RMCF0805FT10K0-Stackpole-Electronics-datasheet-62091608.pdf?src-supplier=Stackpole+Electronics; ComponentLink7URL: https://datasheet.octopart.com:443/RMCF0805FT10K0-Stackpole-Electronics-datasheet-10788263.pdf?src-supplier=Stackpole+Electronics; ComponentLink7Description: https://datasheet.octopart.com:443/RMCF0805FT10K0-Stackpole-Electronics-datasheet-10788263.pdf?src-supplier=Stackpole+Electronics; ComponentLink8URL: https://datasheet.octopart.com:443/RMCF0805FT10K0-Stackpole-Electronics-datasheet-154799224.pdf?src-supplier=JRH+Electronics; ComponentLink8Description: https://datasheet.octopart.com:443/RMCF0805FT10K0-Stackpole-Electronics-datasheet-154799224.pdf?src-supplier=JRH+Electronics; ComponentLink9URL: https://datasheet.octopart.com:443/RMCF0805FT10K0-Stackpole-Electronics-datasheet-11546843.pdf?src-supplier=Arrow+Electronics; ComponentLink9Description: https://datasheet.octopart.com:443/RMCF0805FT10K0-Stackpole-Electronics-datasheet-11546843.pdf?src-supplier=Arrow+Electronics; ComponentLink10URL: https://datasheet.octopart.com:443/RMCF0805FT10K0-Stackpole-Electronics-datasheet-11547379.pdf?src-supplier=Future+Electronics; ComponentLink10Description: https://datasheet.octopart.com:443/RMCF0805FT10K0-Stackpole-Electronics-datasheet-11547379.pdf?src-supplier=Future+Electronics; ComponentLink11URL: https://datasheet.octopart.com:443/RMCF0805FT10K0-Stackpole-Electronics-datasheet-8359789.pdf?src-supplier=Future+Electronics; ComponentLink11Description: https://datasheet.octopart.com:443/RMCF0805FT10K0-Stackpole-Electronics-datasheet-8359789.pdf?src-supplier=Future+Electronics; ComponentLink12URL: https://datasheet.octopart.com:443/RMCF0805FT10K0-Stackpole-Electronics-datasheet-8324226.pdf?src-supplier=Future+Electronics; ComponentLink12Description: https://datasheet.octopart.com:443/RMCF0805FT10K0-Stackpole-Electronics-datasheet-8324226.pdf?src-supplier=Future+Electronics; ComponentLink13URL: https://datasheet.octopart.com:443/RMCF0805FT10K0-Stackpole-Electronics-datasheet-8088878.pdf?src-supplier=Future+Electronics; ComponentLink13Description: https://datasheet.octopart.com:443/RMCF0805FT10K0-Stackpole-Electronics-datasheet-8088878.pdf?src-supplier=Future+Electronics; ComponentLink14URL: https://datasheet.octopart.com:443/RMCF0805FT10K0-Stackpole-Electronics-datasheet-5313682.pdf?src-supplier=Future+Electronics; ComponentLink14Description: https://datasheet.octopart.com:443/RMCF0805FT10K0-Stackpole-Electronics-datasheet-5313682.pdf?src-supplier=Future+Electronics; ComponentLink15URL: http://sigma.octopart.com:80/15940719/materials_sheet/Stackpole-Electronics-RMCF0805FT10K0.pdf?src-supplier=Compliance+Statements; ComponentLink15Description: http://sigma.octopart.com:80/15940719/materials_sheet/Stackpole-Electronics-RMCF0805FT10K0.pdf?src-supplier=Compliance+Statements; ComponentLink16URL: http://sigma.octopart.com:80/141158211/reach_statement/Stackpole-Electronics-RMCF0805FT10K0.pdf?src-supplier=Compliance+Statements; ComponentLink16Description: http://sigma.octopart.com:80/141158211/reach_statement/Stackpole-Electronics-RMCF0805FT10K0.pdf?src-supplier=Compliance+Statements; ComponentLink17URL: http://sigma.octopart.com:80/141158212/rohs_statement/Stackpole-Electronics-RMCF0805FT10K0.pdf?src-supplier=Compliance+Statements; ComponentLink17Description: http://sigma.octopart.com:80/141158212/rohs_statement/Stackpole-Electronics-RMCF0805FT10K0.pdf?src-supplier=Compliance+Statements; LCSC part#: C237755